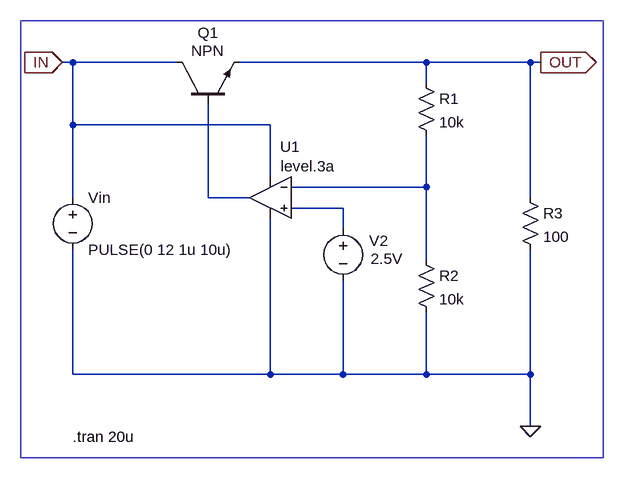
[diagram p0: schematic Switch-Mode Power Supplies - Basso- Figure 1-2.asc]
Switch-Mode Power Supplies - Basso- Figure 1-2.asc, the LTspice schematic file:
Version 4
SHEET 1 880 848
WIRE -416 96 -432 96
WIRE -256 96 -416 96
WIRE 128 96 -160 96
WIRE 288 96 128 96
WIRE 304 96 288 96
WIRE 128 128 128 96
WIRE -416 192 -416 96
WIRE -112 192 -416 192
WIRE -112 272 -112 192
WIRE 128 288 128 208
WIRE 128 288 -80 288
WIRE -416 304 -416 192
WIRE -208 304 -208 160
WIRE -144 304 -208 304
WIRE 288 304 288 96
WIRE 0 320 -80 320
WIRE 0 352 0 320
WIRE 128 400 128 288
WIRE -416 576 -416 384
WIRE -112 576 -112 336
WIRE -112 576 -416 576
WIRE 0 576 0 432
WIRE 0 576 -112 576
WIRE 128 576 128 480
WIRE 128 576 0 576
WIRE 288 576 288 384
WIRE 288 576 128 576
WIRE 288 656 288 576
FLAG 288 656 0
FLAG 304 96 OUT
IOPIN 304 96 Out
FLAG -432 96 IN
IOPIN -432 96 In
SYMBOL opamps\\UniversalOpamp2 -112 304 M0
WINDOW 38 -16 -48 Right 0
WINDOW 0 -15 -78 Right 0
SYMATTR SpiceModel level.3a
SYMATTR InstName U1
SYMBOL voltage 0 336 R0
WINDOW 123 0 0 Left 0
WINDOW 39 0 0 Left 0
WINDOW 0 40 34 Left 0
WINDOW 3 42 62 Left 0
SYMATTR InstName V2
SYMATTR Value 2.5V
SYMBOL npn -256 160 R270
WINDOW 0 110 32 VRight 0
WINDOW 3 82 22 VRight 0
SYMATTR InstName Q1
SYMBOL res 112 112 R0
SYMATTR InstName R1
SYMATTR Value 10k
SYMBOL res 112 384 R0
SYMATTR InstName R2
SYMATTR Value 10k
SYMBOL res 272 288 R0
SYMATTR InstName R3
SYMATTR Value 100
SYMBOL voltage -416 288 R0
WINDOW 123 0 0 Left 0
WINDOW 39 0 0 Left 0
SYMATTR InstName Vin
SYMATTR Value PULSE(0 12 1u 10u)
TEXT -416 672 Left 0 !.tran 20u
RECTANGLE Normal 400 704 -496 32

The netlist it stands for:
* Switch-Mode Power Supplies - Basso- Figure 1-2.asc
XU1 N003 N001 IN 0 N002 level.3a Avol=1Meg GBW=10Meg Slew=10Meg ilimit=25m rail=0 Vos=0 phimargin=45 en=0 enk=0 in=0 ink=0 Rin=500Meg  ; pins IN+ IN- V+ V- OUT
V2 N003 0 2.5V
Q1 IN N002 OUT 0 NPN
R1 OUT N001 10k
R2 N001 0 10k
R3 OUT 0 100
Vin IN 0 PULSE(0 12 1u 10u)
.model NPN NPN
.model PNP PNP
.lib standard.bjt
.tran 20u
.lib UniversalOpamps2.sub
.backanno
.end